# Altium project ZLG_PrjCandleLight_F072.PrjPcb
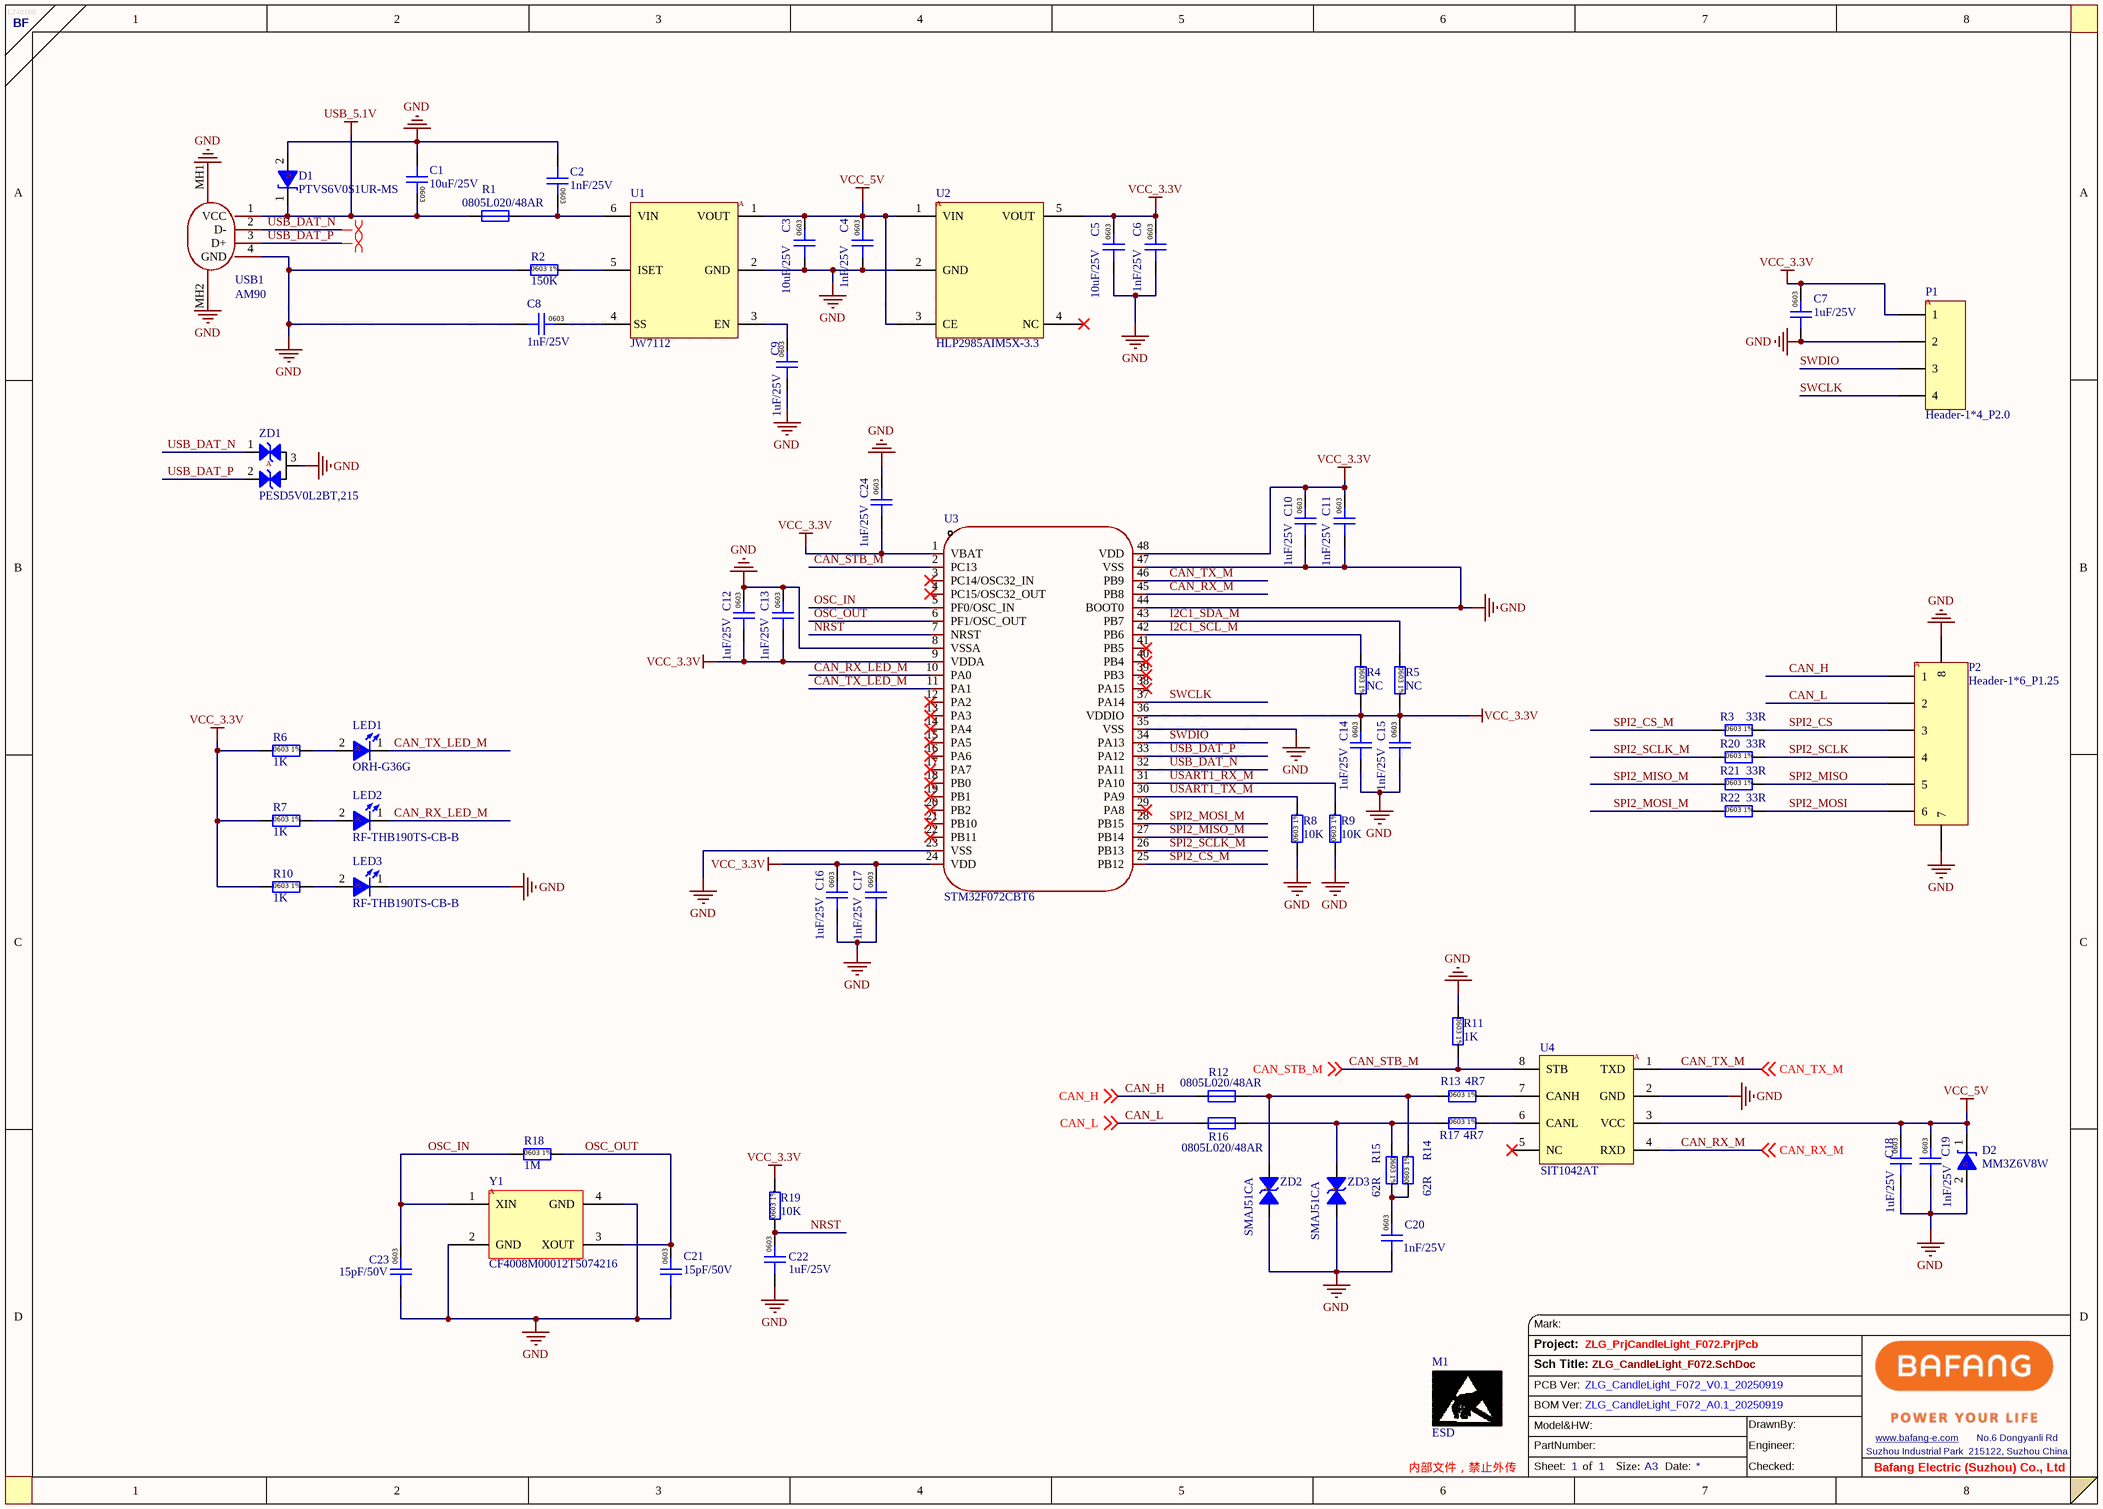
[diagram p0: ZLG_CandleLight_F072.SchDoc]
1 sheet, 63 parts. Net scope: global (net labels, ports and power ports of the same name join across sheets).
Board file: ZLG_CandleLight_F072_V0.1_20250919.PcbDoc

## Sheet ZLG_CandleLight_F072.SchDoc: Title
size A3; E_PCB Version: ZLG_CandleLight_F072_V0.1_20250919; CompanyName: Bafang Electric (Suzhou) Co., Ltd; E_BOM Version: ZLG_CandleLight_F072_A0.1_20250919; Address1: www.bafang-e.com; Address2: No.6 Dongyanli Rd; Address3: Suzhou Industrial Park; Address4: 215122, Suzhou China; SheetNumber: 1; SheetTotal: 1; Size: A3

### Parts
C1  10uF/25V  [C-0603]
C2  1nF/25V  [C-0603]
C3  10uF/25V  [C-0603]
C4  1nF/25V  [C-0603]
C5  10uF/25V  [C-0603]
C6  1nF/25V  [C-0603]
C7  1uF/25V  [C-0603]
C8  1nF/25V  [C-0603]
C9  1uF/25V  [C-0603]
C10  1uF/25V  [C-0603]
C11  1nF/25V  [C-0603]
C12  1uF/25V  [C-0603]
C13  1nF/25V  [C-0603]
C14  1uF/25V  [C-0603]
C15  1nF/25V  [C-0603]
C16  1uF/25V  [C-0603]
C17  1nF/25V  [C-0603]
C18  1uF/25V  [C-0603]
C19  1nF/25V  [C-0603]
C20  1nF/25V  [C-0603]
C21  15pF/50V  [C-0603]
C22  1uF/25V  [C-0603]
C23  15pF/50V  [C-0603]
C24  1uF/25V  [C-0603]
D1  PTVS6V0S1UR-MS  [SOD-123W]
D2  MM3Z6V8W  [SOD-123]
LED1  ORH-G36G  [LED-SMT-0603]
LED2  RF-THB190TS-CB-B  [LED-SMT-0603]
LED3  RF-THB190TS-CB-B  [LED-SMT-0603]
M1  ESD  [ESD-5*4mm]
P1  Header-1*4_P2.0  [CON-1*4-P2.0-Download]
P2  Header-1*6_P1.25  [CON-1*6-P1.25]
R1  0805L020/48AR  [R-0805]
R2  150K  [R-0603]
R3  33R  [R-0603]
R4  NC  [R-0603]
R5  NC  [R-0603]
R6  1K  [R-0603]
R7  1K  [R-0603]
R8  10K  [R-0603]
R9  10K  [R-0603]
R10  1K  [R-0603]
R11  1K  [R-0603]
R12  0805L020/48AR  [R-0805]
R13  4R7  [R-0603]
R14  62R  [R-0603]
R15  62R  [R-0603]
R16  0805L020/48AR  [R-0805]
R17  4R7  [R-0603]
R18  1M  [R-0603]
R19  10K  [R-0603]
R20  33R  [R-0603]
R21  33R  [R-0603]
R22  33R  [R-0603]
U1  JW7112  [SOT-23-6]
U2  HLP2985AIM5X-3.3  [SOT-23-5]
U3  STM32F072CBT6  [LQFP-48_L7.0-W7.0-P0.50-LS9.0-BL]
U4  SIT1042AT  [SOP-8]
USB1  AM90  [USB-AM-TH_AM90]
Y1  CF4008M00012T5074216  [CRYSTAL-SMT_3225-4P]
ZD1  PESD5V0L2BT,215  [SOT-23-3]
ZD2  SMAJ51CA  [SMA(DO-214AC)]
ZD3  SMAJ51CA  [SMA(DO-214AC)]

### Nets
GND: C1.1 C2.1 C3.1 C4.1 C5.1 C6.1 C7.1 C8.1 C9.1 C10.1 C11.1 C12.2 C13.2 C14.1 C15.1 C16.1 C17.1 C18.1 C19.1 C20.1 C21.1 C22.1 C23.1 C24.2 D1.2(A) D2.2(A) LED3.1(C) P1.2 P2.7 P2.8 R2.1 R8.1 R9.1 R11.1 U1.2(GND) U2.2(GND) U3.8(VSSA) U3.23(VSS) U3.35(VSS) U3.44(BOOT0) U3.47(VSS) U4.2(GND) USB1.4(GND) USB1.MH1 USB1.MH2 Y1.2(GND) Y1.4(GND) ZD1.3 ZD2.1 ZD3.1
USB_5.1V: C1.2 D1.1(C) R1.1 USB1.1(VCC)
VCC_3.3V: C5.2 C6.2 C7.2 C10.2 C11.2 C12.1 C13.1 C14.2 C15.2 C16.2 C17.2 C24.1 P1.1 R4.2 R5.2 R6.1 R7.1 R10.1 R19.2 U2.5(VOUT) U3.1(VBAT) U3.9(VDDA) U3.24(VDD) U3.36(VDDIO) U3.48(VDD)
VCC_5V: C3.2 C4.2 C18.2 C19.2 D2.1(C) U1.1(VOUT) U2.1(VIN) U2.3(CE) U4.3(VCC)
CAN_H: P2.1 R12.1 ; off-sheet CAN_H
CAN_L: P2.2 R16.1 ; off-sheet CAN_L
CAN_RX_LED_M: LED2.1(C) U3.10(PA0)
CAN_RX_M: U3.45(PB8) U4.4(RXD) ; off-sheet CAN_RX_M
CAN_STB_M: R11.2 U3.2(PC13) U4.8(STB) ; off-sheet CAN_STB_M
CAN_TX_LED_M: LED1.1(C) U3.11(PA1)
CAN_TX_M: U3.46(PB9) U4.1(TXD) ; off-sheet CAN_TX_M
I2C1_SCL_M: R4.1 U3.42(PB6)
I2C1_SDA_M: R5.1 U3.43(PB7)
NRST: C22.2 R19.1 U3.7(NRST)
OSC_IN: C23.2 R18.1 U3.5(PF0/OSC_IN) Y1.1(XIN)
OSC_OUT: C21.2 R18.2 U3.6(PF1/OSC_OUT) Y1.3(XOUT)
SPI2_CS: P2.3 R3.2
SPI2_CS_M: R3.1 U3.25(PB12)
SPI2_MISO: P2.5 R21.2
SPI2_MISO_M: R21.1 U3.27(PB14)
SPI2_MOSI: P2.6 R22.2
SPI2_MOSI_M: R22.1 U3.28(PB15)
SPI2_SCLK: P2.4 R20.2
SPI2_SCLK_M: R20.1 U3.26(PB13)
SWCLK: P1.4 U3.37(PA14)
SWDIO: P1.3 U3.34(PA13)
USART1_RX_M: R9.2 U3.31(PA10)
USART1_TX_M: R8.2 U3.30(PA9)
USB_DAT_N: U3.32(PA11) USB1.2(D-) ZD1.1
USB_DAT_P: U3.33(PA12) USB1.3(D+) ZD1.2
NetC2_2: C2.2 R1.2 U1.6(VIN)
NetC8_2: C8.2 U1.4(SS)
NetC9_2: C9.2 U1.3(EN)
NetC20_2: C20.2 R14.1 R15.2
NetLED1_2: LED1.2(A) R6.2
NetLED2_2: LED2.2(A) R7.2
NetLED3_2: LED3.2(A) R10.2
NetR2_2: R2.2 U1.5(ISET)
NetR12_2: R12.2 R13.1 R14.2 ZD2.2
NetR13_2: R13.2 U4.7(CANH)
NetR15_1: R15.1 R16.2 R17.1 ZD3.2
NetR17_2: R17.2 U4.6(CANL)

Not connected (* = marked no-connect by the designer): U2 4(NC)*; U3 3(PC14/OSC32_IN)* 4(PC15/OSC32_OUT)* 12(PA2)* 13(PA3)* 14(PA4)* 15(PA5)* 16(PA6)* 17(PA7)* 18(PB0)* 19(PB1)* 20(PB2)* 21(PB10)* 22(PB11)* 29(PA8)* 38(PA15)* 39(PB3)* 40(PB4)* 41(PB5)*; U4 5(NC)*

### Layout directives
differential pair: USB_DAT_N, USB_DAT_P

### Notes on the sheet
- BF
- L240108
- 八方电气(苏州)股份有限公司
- Mark:
- Project:
- Sch Title:
- PCB Ver:
- Title
- 内部文件，禁止外传
- BOM Ver:
- Model&HW:
- PartNumber:
- DrawnBy:
- Engineer:
- Size:
- Date:
- File:
- Orcad E
- Number:
- Time:
- Revision:
- Sheet
- of
- Sheet:
- Checked:
- (in symbol CC0603J150-9) 0603
- (in symbol CC0603K102-8) 0603
- (in symbol CC0603K105-8) 0603
- (in symbol CC0603K106-8) 0603
- (in symbol CF4008M00012T5074216) A
- (in symbol Header-1*4_P2.0) A
- (in symbol Header-1*6_P1.25) A
- (in symbol HLP2985AIM5X-3.3) A
- (in symbol JW7112) A
- (in symbol PESD5V0L2BT,215) A
- (in symbol RC0603F1K) 0603 1%
- (in symbol RC0603F1M) 0603 1%
- (in symbol RC0603F4R7) 0603 1%
- (in symbol RC0603F10K) 0603 1%
- (in symbol RC0603F33R) 0603 1%
- (in symbol RC0603F62R) 0603 1%
- (in symbol RC0603F150K) 0603 1%
- (in symbol SIT1042AT) A
- (in symbol SMAJ51CA) A

### Library data of the parts
C1 C3 C5 = CC0603K106-8: 10μF, 25V, ±10%, -55to85℃; Manufacture: YAGEO/厚声/风华/WALSIN/村田; Material Name: 贴片电容; Code: CC0603KRX5R8BB106; Supplier: *; Design Item ID: CC0603K106-8
C2 C4 C6 C8 C11 C13 C15 C17 C19 C20 = CC0603K102-8: 1nF, 25V, ±10%, -55to125℃; Manufacture: YAGEO/厚声/风华/WALSIN/村田; Material Name: 贴片电容; Code: CC0603KRX7R8BB102; Supplier: *; Design Item ID: CC0603K102-8
C7 C9 C10 C12 C14 C16 C18 C22 C24 = CC0603K105-8: 1μF, 25V, ±10%, -55to125℃; Manufacture: YAGEO/厚声/风华/WALSIN/村田; Material Name: 贴片电容; Code: CC0603KRX7R8BB105; Supplier: *; Design Item ID: CC0603K105-8
C21 C23 = CC0603J150-9: 15pF, 50V, ±5%,, -55to125℃; Manufacture: YAGEO/厚声/风华/WALSIN/村田; Material Name: 贴片电容; Code: CC0603JRNPO9BN150; Supplier: *; Design Item ID: CC0603J150-9
D1 = PTVS6V0S1UR-MS: TVS管 VR=6V,峰值脉冲电流（IPP）=38.84A,最大钳位电压:：10.3V; Manufacture: MSKSEMI(美森科); Supplier: *; Material Name: TVS管; MPN: PTVS6V0S1UR-MS; ComponentLink1Description: Datasheet; ComponentLink1URL: O:\ECU\B02_Hardware硬件\A02_Libraries 原理图PCB封装库\Datasheet\Semicon\TVS二极管_PTVS5V0S1UR-MS.PDF; Design Item ID: PTVS6V0S1UR-MS
D2 = MM1Z6V8W: 稳压二极管   Vzt:6.8V,  ±5%    0.5W  Izt:5mA,-65to150℃; Manufacture: JESTEK; Supplier: 聚创; Material Name: 稳压二极管; MPN: MM1Z6V8W; ComponentLink1Description: Datasheet; ComponentLink1URL: O:\ECU\B02_Hardware硬件\A02_Libraries 原理图PCB封装库\Datasheet\Semicon\稳压二极管_MM1Z2V0W-MM1Z75W.pdf; Design Item ID: MM1Z6V8W
LED1 = ORH-G36G: 发光二极管  GREEN, 2.8V, 30mA, -25to80℃; Manufacture: ORIENT; Material Name: LED; Supplier: *; MPN: ORH-G36G; ComponentLink1Description: Datasheet; ComponentLink1URL: O:\ECU\B02_Hardware硬件\A02_Libraries 原理图PCB封装库\Datasheet\Semicon\发光二极管_ORH-G36G.pdf; Design Item ID: ORH-G36G
LED2 LED3 = RF-THB190TS-CB-B: 发光二极管  GREEN, 2.8V, -40to85℃; Manufacture: 瑞丰; Material Name: LED; Supplier: *; MPN: RF-THB190TS-CB-B; ComponentLink1Description: Datasheet; ComponentLink1URL: O:\ECU\B02_Hardware硬件\A02_Libraries 原理图PCB封装库\Datasheet\Semicon\发光二极管_RF-THB190TS-CB-B.pdf; Design Item ID: RF-THB190TS-CB-B
P1 = Header-1*4_P2.0: Header, 4Pin .P2.0; Material Name: 接插件; MPN: *; Manufacture: *; Supplier: *; Design Item ID: Header-1*4_P2.0
P2 = Header-1*6_P1.25: Header, 6Pin, P1.25; MPN: A12514WR-S-06PNLNT1T00R; Manufacture: HR(灿达); Material Name: 接插件; Supplier: *; ComponentLink1Description: Datasheet; ComponentLink1URL: O:\ECU\B02_Hardware硬件\A02_Libraries 原理图PCB封装库\Datasheet\Connectors\线对板针座_A12514WR-S-06PNLNT1T00R.PDF; Design Item ID: Header-1*6_P1.25
R1 R12 R16 = F0805-020-48V: 自恢复保险丝  耐压: 48V  最大电流: 40A  保持电流(Ih): 200mA  跳闸电流: 500mA; Manufacture: LUTE(陆特); Material Name: 自恢复保险丝; Supplier: *; Design Item ID: F0805-020-48V; MPN: 0805L020/48AR; ComponentLink1Description: Datasheet; ComponentLink1URL: O:\ECU\B02_Hardware硬件\A02_Libraries 原理图PCB封装库\Datasheet\RLC\自恢复保险丝_0805L020-48AR.PDF
R2 = RC0603F150K: 150KΩ, 0.1W, 1%, -55to155℃; Manufacture: YAGEO/厚声/风华/WALSIN/大毅; Material Name: 贴片电阻; Code: RC0603FR-07150KL; Supplier: *; Design Item ID: RC0603F150K
R3 R20-R22 = RC0603F33R: 33Ω, 0.1W, 1%, -55to155℃; Manufacture: YAGEO/厚声/风华/WALSIN/大毅; Material Name: 贴片电阻; Code: RC0603FR-0733RL; Supplier: *; Design Item ID: RC0603F33R
R4 R5 R8 R9 R19 = RC0603F10K: 10KΩ, 0.1W, 1%, -55to155℃; Manufacture: YAGEO/厚声/风华/WALSIN/大毅; Material Name: 贴片电阻; Code: RC0603FR-0710KL; Supplier: *; Design Item ID: RC0603F10K
R6 R7 R10 R11 = RC0603F1K: 1KΩ, 0.1W, 1%, -55to155℃; Manufacture: YAGEO/厚声/风华/WALSIN/大毅; Material Name: 贴片电阻; Code: RC0603FR-071KL; Supplier: *; Design Item ID: RC0603F1K
R13 R17 = RC0603F4R7: 4.7Ω, 0.1W, 1%, -55to155℃; Manufacture: YAGEO/厚声/风华/WALSIN/大毅; Material Name: 贴片电阻; Code: RC0603FR-074R7L; Supplier: *; Design Item ID: RC0603F4R7
R14 R15 = RC0603F62R: 62Ω, 0.1W, 1%, -55to155℃; Manufacture: YAGEO/厚声/风华/WALSIN/大毅; Material Name: 贴片电阻; Code: RC0603FR-0762RL; Supplier: *; Design Item ID: RC0603F62R
R18 = RC0603F1M: 1MΩ, 0.1W, 1%, -55to155℃; Manufacture: YAGEO/厚声/风华/WALSIN/大毅; Material Name: 贴片电阻; Code: RC0603FR-071ML; Supplier: *; Design Item ID: RC0603F1M
U1 = JW7112: 高边热插拔控制器   工作电压范围：2.8V至16V，导通电阻：50mΩ，最大3A可持续电流; Manufacture: JOULWATT; Material Name: 高边热插拔控制器; Supplier: *; MPN: JW7112; ComponentLink1Description: Datasheet; ComponentLink1URL: O:\ECU\B02_Hardware硬件\A02_Libraries 原理图PCB封装库\Datasheet\IC\高边热插拔控制器_JW7112.pdf; Design Item ID: JW7112
U2 = HLP2985AIM5X-3.3: LDO,工作电压16V，输出电压3.3V，输出电流150mA，-40℃~+125℃; Manufacture: HXY MOSFET(华轩阳电子); Material Name: 线性稳压器(LDO); Supplier: *; MPN: HLP2985AIM5X-3.3; ComponentLink1Description: Datasheet; ComponentLink1URL: O:\ECU\B02_Hardware硬件\A02_Libraries 原理图PCB封装库\Datasheet\IC\LDO_HLP2985AIM5X-3.3.pdf; Design Item ID: HLP2985AIM5X-3.3
U3 = STM32F072CBT6: Manufacturer: ST(意法半导体); Add into BOM: yes; CPU Core: ARM-M0; CPU Maximum Speed: 48MHz; Program Storage Size: 128KB; Program Memory Type: FLASH; Number of I/O: 37; ADC (Bit): 12bit; Voltage - Supply: 1.65V~3.6V; Symbol: STM32F072CBT6; Device: STM32F072CBT6; LCSC Part Name: 主流ARM Cortex-M0 USB系列MCU，具有128 KB Flash、48 MHz CPU、USB、CAN和CEC功能; Supplier Part: C81720; Manufacturer Part: STM32F072CBT6; Supplier Footprint: LQFP-48(7x7); JLCPCB Part Class: 扩展库; Datasheet: https://atta.szlcsc.com/upload/public/pdf/source/20171102/C125825_15096092762561078351.pdf; Supplier: LCSC; Convert to PCB: yes; DAC (Bit): 12bit; Applications: -
U4 = SIT1042AT: CAN芯片   5V 供电，±70V 总线耐压，待机模式CAN FD 总线收发器; Manufacture: SIT; Material Name: CAN芯片; Supplier: *; MPN: SIT1042AT; ComponentLink1Description: Datasheet; ComponentLink1URL: O:\ECU\B02_Hardware硬件\A02_Libraries 原理图PCB封装库\Datasheet\IC\CAN芯片_SIT1042AT.pdf; Design Item ID: SIT1042AT
USB1 = AM90: Manufacturer: SHOU HAN(首韩); Add into BOM: yes; Connector Type: Type-A; Gender: 公; Number of Contacts: 4P; Number of Ports: 1; Current Rating - Power (Max): 1.5A; Rated Voltage (Max): 30V; Connect-Disconnect Life: 5千次; Core Colour: 白色; Symbol: AM90; Device: AM90; LCSC Part Name: Type-A 公 弯插; Supplier Part: C404965; Manufacturer Part: AM90; Supplier Footprint: 插件; JLCPCB Part Class: 扩展库; Datasheet: https://atta.szlcsc.com/upload/public/pdf/source/20190722/C404965_9CC10BE28E3F9E5134758D030387C529.pdf; Supplier: LCSC; Convert to PCB: yes; Standard: USB 2.0; Mounting Style: 弯插; Supplementary Features: -; Center Height: -; Length: 18.8mm; Operating Temperature Range: -25℃~+85℃
Y1 = CF4008M00012T5074216: 8MHZ,SMD_3225,贴片无源晶振; Manufacture: 晶威特; Material Name: 贴片晶振; Supplier: 思泽; MPN: CF4008M00012T5074216; ComponentLink1Description: Datasheet; ComponentLink1URL: O:\ECU\B02_Hardware硬件\A02_Libraries 原理图PCB封装库\Datasheet\Semicon\晶振_CF4008M00012T5074216.PDF; Design Item ID: CF4008M00012T5074216
ZD1 = PESD5V0L2BT,215: 静电放电(ESD)保护管  Vbr:8.2V, Vrwm:5V, TVS二极管 1uA 5V, -65°C-150°C,; Manufacture: Nexperia; Material Name: 静电放电(ESD)保护管; Supplier: *; MPN: PESD5V0L2BT,215; ComponentLink1Description: Datasheet; ComponentLink1URL: O:\ECU\B02_Hardware硬件\A02_Libraries 原理图PCB封装库\Datasheet\Semicon\TVS二极管_PESD5V0L2BT,215.pdf; Design Item ID: PESD5V0L2BT,215
ZD2 ZD3 = SMAJ51CA: 双向TVS 51V截止 4.9A峰值脉冲 反向截止电压(Vrwm):51V 最大钳位电压:82.4V 峰值脉冲电流(Ipp)@10/1000us:4.9A 峰值脉冲功率(Ppp)@10/1000us:400W 击穿电压:56.7V VRWM=51V,Vc=82.4V,Ipp=4.9A 双向; Manufacture: CJ; Supplier: *; Material Name: 双向TVS; MPN: SMAJ51CA; ComponentLink1Description: Datasheet; ComponentLink1URL: O:\ECU\B02_Hardware硬件\A02_Libraries 原理图PCB封装库\Datasheet\Semicon\TVS二极管_SMAJ51CA.pdf; Design Item ID: SMAJ51CA
M1 = ESD: Design Item ID: ESD